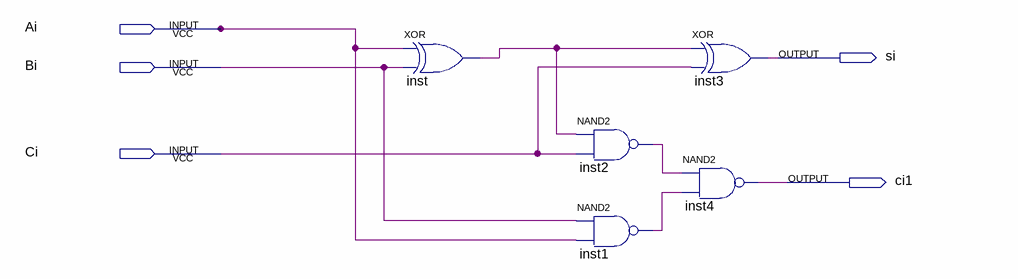
[diagram p0: schematic sheet]
// Quartus schematic Quanjia.bdf as structural Verilog: 5 symbols, 5 pins
module Quanjia (
  input  Ai,
  input  Bi,
  input  Ci,
  output si,
  output ci1
);

  wire inst1_out, inst2_out, inst_out;

  xor inst (inst_out, Ai, Bi);
  nand inst2 (inst2_out, inst_out, Ci);
  nand inst1 (inst1_out, Bi, Ai);
  xor inst3 (si, inst_out, Ci);
  nand inst4 (ci1, inst2_out, inst1_out);
endmodule
